# Altium schematic sheet TLE8209-2SA.SchDoc
size A4; SheetNumber: 7; SheetTotal: 8
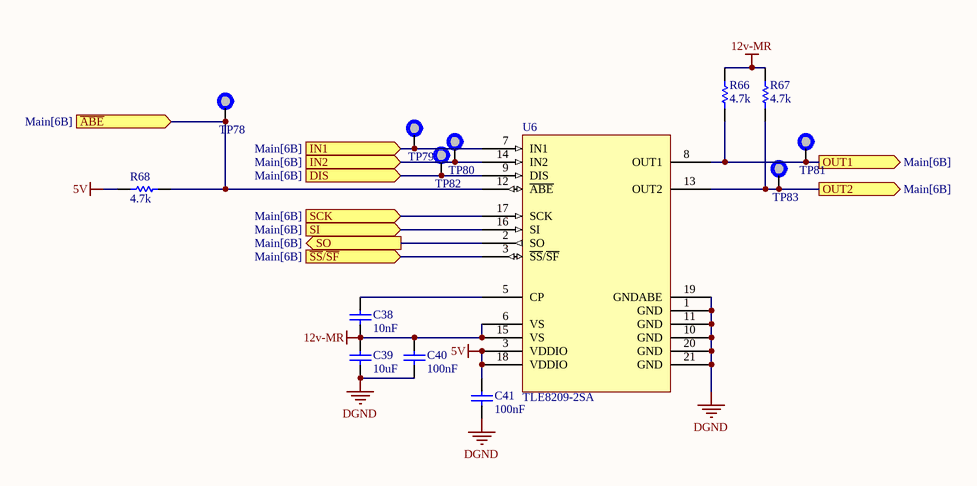
[diagram p0: TLE8209-2SA.SchDoc]

## Parts
C38  value 10nF  [0603C]  (hidden comment: CGA3E2X7R1H104K080AA)
C39  value 10uF  [0805C]  (hidden comment: CGA3E2X7R1H104K080AA)
C40  value 100nF  [0603C]  (hidden comment: CGA3E2X7R1H104K080AA)
C41  value 100nF  [0603C]  (hidden comment: CGA3E2X7R1H104K080AA)
R66  value 4.7k  [1206]  (hidden comment: Res1)
R67  value 4.7k  [1206]  (hidden comment: Res1)
R68  value 4.7k  [1206]  (hidden comment: Res1)
TP78  TestPoint  [TP]  (value not drawn)
TP79  TestPoint  [TP]  (value not drawn)
TP80  TestPoint  [TP]  (value not drawn)
TP81  TestPoint  [TP]  (value not drawn)
TP82  TestPoint  [TP]  (value not drawn)
TP83  TestPoint  [TP]  (value not drawn)
U6  TLE8209-2SA  [TLE8209-2SA]

## Ports
DIS (in, see Main[6B]), IN1 (in, see Main[6B]), IN2 (in, see Main[6B]), OUT1 (out, see Main[6B]), OUT2 (out, see Main[6B]), SCK (in, see Main[6B]), SI (in, see Main[6B]), SO (out, see Main[6B]), ~{ABE} (in, see Main[6B]), ~{SS}/~{SF} (in, see Main[6B])

## Nets
5V: C41.1 R68.1 U6.3(VDDIO) U6.18(VDDIO)
12v-MR: C38.2 C39.1 C40.1 R66.1 R67.1 U6.6(VS) U6.15(VS)
DGND: C39.2 C40.2 C41.2 U6.1(GND) U6.10(GND) U6.11(GND) U6.19(GNDABE) U6.20(GND) U6.21(GND)
~{ABE}: R68.2 TP78.1 U6.12(~{ABE}) ; port ~{ABE}
DIS: TP82.1 U6.9(DIS) ; port DIS
IN1: TP79.1 U6.7(IN1) ; port IN1
IN2: TP80.1 U6.14(IN2) ; port IN2
OUT1: R66.2 TP81.1 U6.8(OUT1) ; port OUT1
OUT2: R67.2 TP83.1 U6.13(OUT2) ; port OUT2
~{SS}/~{SF}: U6.3(~{SS}/~{SF}) ; port ~{SS}/~{SF}
SCK: U6.17(SCK) ; port SCK
SI: U6.16(SI) ; port SI
SO: U6.2(SO) ; port SO
NetC38_1: C38.1 U6.5(CP)

## Library data of the parts
C38-C41 = Cap: Capacitor; Published: 8-Jun-2000; LatestRevisionDate: 17-Jul-2002; LatestRevisionNote: Re-released for DXP Platform.; PackageReference: RAD-0.3; Publisher: Altium Limited; PackageDescription: Radial Cap, Thru-Hole; 2 Leads; 0.3 in Pin Spacing
R66-R68 = Res1: Resistor; Published: 8-Jun-2000; LatestRevisionDate: 17-Jul-2002; LatestRevisionNote: Re-released for DXP Platform.; PackageReference: AXIAL-0.3; Publisher: Altium Limited; PackageDescription: Axial Device, Thru-Hole; 2 Leads; 0.3 in Pin Spacing